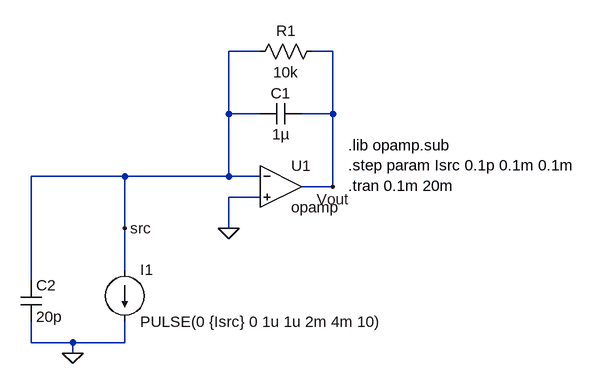
[diagram p0: schematic Draft1.asc]
Draft1.asc, the LTspice schematic file:
Version 4
SHEET 1 956 680
WIRE 448 -32 400 -32
WIRE 560 -32 528 -32
WIRE 400 64 400 -32
WIRE 448 64 400 64
WIRE 560 64 560 -32
WIRE 560 64 512 64
WIRE 240 160 96 160
WIRE 400 160 400 64
WIRE 400 160 240 160
WIRE 448 160 400 160
WIRE 560 176 560 64
WIRE 560 176 512 176
WIRE 448 192 400 192
WIRE 240 240 240 160
WIRE 400 240 400 192
WIRE 240 304 240 240
WIRE 96 320 96 160
WIRE 96 416 96 384
WIRE 160 416 96 416
WIRE 240 416 240 384
WIRE 240 416 160 416
WIRE 160 432 160 416
FLAG 400 240 0
FLAG 160 432 0
FLAG 560 176 Vout
FLAG 240 240 src
SYMBOL current 240 304 R0
WINDOW 123 0 0 Left 2
SYMATTR InstName I1
SYMATTR Value PULSE(0 {Isrc} 0 1u 1u 2m 4m 10)
SYMBOL cap 512 48 R90
WINDOW 0 0 32 VBottom 2
WINDOW 3 32 32 VTop 2
SYMATTR InstName C1
SYMATTR Value 1µ
SYMBOL res 544 -48 R90
WINDOW 0 0 56 VBottom 2
WINDOW 3 32 56 VTop 2
SYMATTR InstName R1
SYMATTR Value 10k
SYMBOL cap 80 320 R0
SYMATTR InstName C2
SYMATTR Value 20p
SYMBOL Opamps/opamp 480 112 R0
SYMATTR InstName U1
TEXT 584 112 Left 2 !.lib opamp.sub\n.step param Isrc 0.1p 0.1m 0.1m\n.tran 0.1m 20m

The netlist it stands for:
* Draft1.asc
I1 src 0 PULSE(0 {Isrc} 0 1u 1u 2m 4m 10)
C1 Vout src 1µ
R1 Vout src 10k
C2 src 0 20p
XU1 src 0 Vout opamp Aol=100K GBW=10Meg  ; pins invin noninvin out
.lib opamp.sub
.step param Isrc 0.1p 0.1m 0.1m
.tran 0.1m 20m
.backanno
.end